# EAGLE design rev_a (EAGLE 7.6.0)
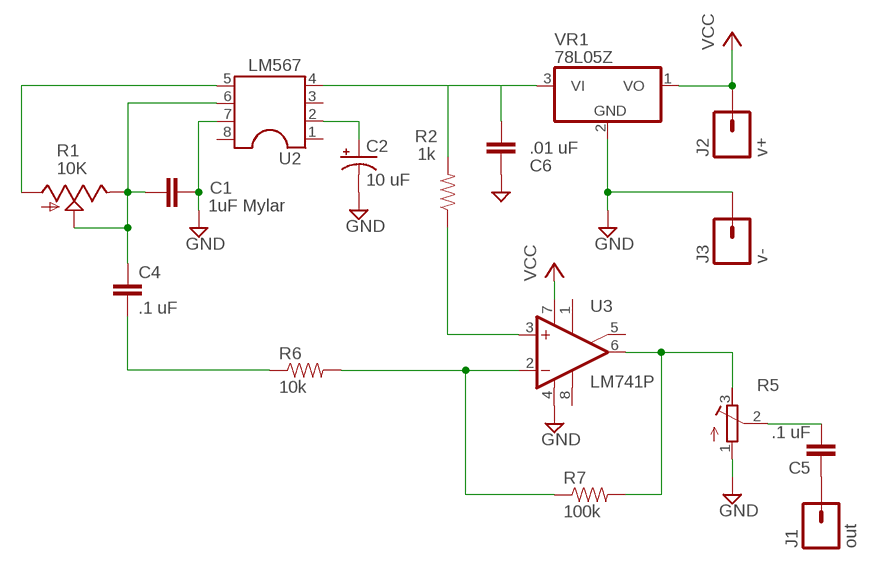
[diagram p0: schematic, sheet 1]

## Parts
C1  1uF Mylar  C5/2.5  [C5B2.5]
C2  10 uF  CAP_POLPTH2  [CPOL-RADIAL-10UF-25V]
C4  .1 uF  C2.5/2  [C2.5-2]
C5  .1 uF  CAPPTH2  [CAP-PTH-SMALL2]
C6  .01 uF  C2.5/2  [C2.5-2]
J1  out  M01OFFSET  [1X01_OFFSET]
J2  v+  M01OFFSET  [1X01_OFFSET]
J3  v-  M01OFFSET  [1X01_OFFSET]
R1  10K  TRIM_US-S64W  [S64W]
R2  1k  1KOHM-1/4W-5%(PTH)VERT  [AXIAL-0.1]
R5  RTRIM-3362P  [RTRIM3362P]
R6  10k  1KOHM-1/4W-5%(PTH)VERT  [AXIAL-0.1]
R7  100k  1KOHM-1/4W-5%(PTH)VERT  [AXIAL-0.1]
U2  LM567  DIL8  [DIL08]
U3  LM741P  [DIL08]
VR1  78L05Z  [TO92]

## Nets
GND: C2.2(-) C6.2 J3.1 R5.1 U3.4(V-) VR1.2(GND)
N$1: C6.1 U2.4 VR1.3(VI)
N$2: R2.P$1 U3.3(+IN)
N$3: R6.P$2 R7.P$1 U3.2(-IN)
N$4: R5.3 R7.P$2 U3.6(OUT)
N$5: C5.2 R5.2
N$6: C4.2 R6.P$1
N$7: C2.1(+) U2.2
N$8: C1.1 C4.1 R1.E R1.S U2.6
N$9: C1.2 U2.7 ; supply symbol labelled GND
N$10: R1.A U2.5
N$11: C5.1 J1.1
N$12: R2.P$2
VCC: J2.1 U3.7(V+) VR1.1(VO)
Unconnected: U2.1 U2.3 U2.8 U3.1(ON1) U3.5(ON2) U3.8(OPT)

## Library data of the parts
C1 C4 C6 = capacitor-wima:C: CAPACITOR naming: grid - package width
C2 = SparkFun-Capacitors:CAP_POL: Capacitor Polarized These are standard SMD and PTH capacitors. Normally 10uF, 47uF, and 100uF in electrolytic and tantalum varieties. Always verify the external diameter of the through hole cap, it varies with capacity, voltage, and manufacturer. The EIA devices should be standard.
C5 = SparkFun-Capacitors:CAP: Capacitor Standard 0603 ceramic capacitor, and 0.1" leaded capacitor.
J1-J3 = SparkFun-Connectors:M01: Header 1 Standard 1-pin 0.1" header. Use with straight break away headers (SKU : PRT-00116), right angle break away headers (PRT-00553), swiss pins (PRT-00743), machine pins (PRT-00117), and female headers (PRT-00115). SMTSO-256-ET is a "flush mount" nut for a 4-40 screw. The older package used to be too tight, and did not allow it to sit properly thru the drill hit. The latest (0.165DIA) fits nice and snug.
R1 = pot:TRIM_US-: POTENTIOMETER
R2 = SparkFun-Resistors:1KOHM-1/4W-5%(PTH): RES-08380; PROD_ID: RES-08380
R5 = GeekAmmo:RTRIM: BOURNS 3362 - 1/4" Square Trimpot® Trimming Potentiometer
R6 R7 = SparkFun-Resistors:1KOHM-1/4W-5%(PTH): RES-08380; PROD_ID: RES-08380; VALUE: 1k
U2 = ic-package:DIL8: Dual In Line / Socket
U3 = linear:*741: OP AMP
VR1 = linear:78*: Positive VOLTAGE REGULATOR Source: http://cache.national.com/ds/LM/LM78L05.pdf http://www.fairchildsemi.com/ds/LM/LM7805.pdf

## Board
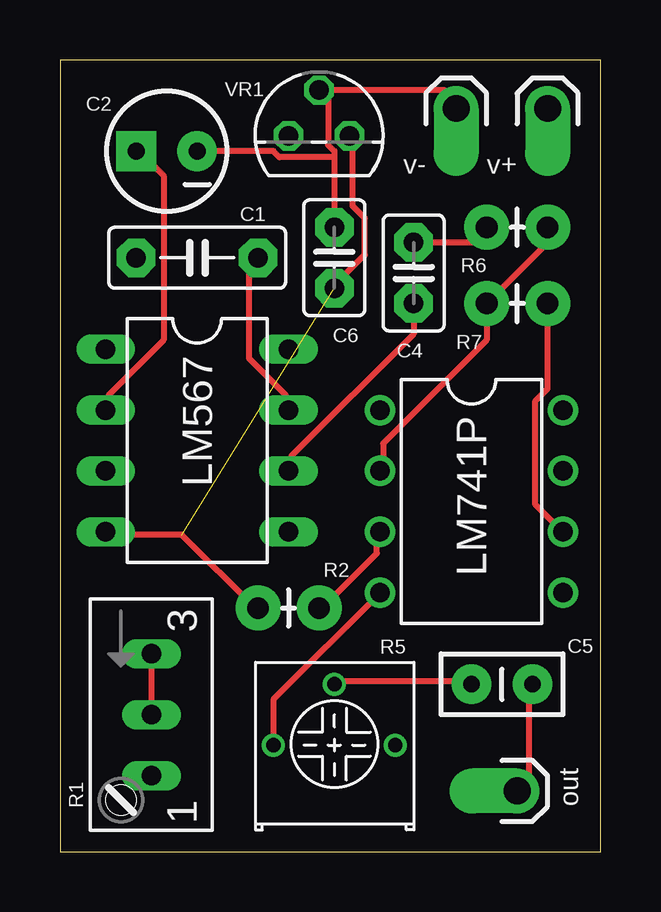
[diagram p1: board, top side]
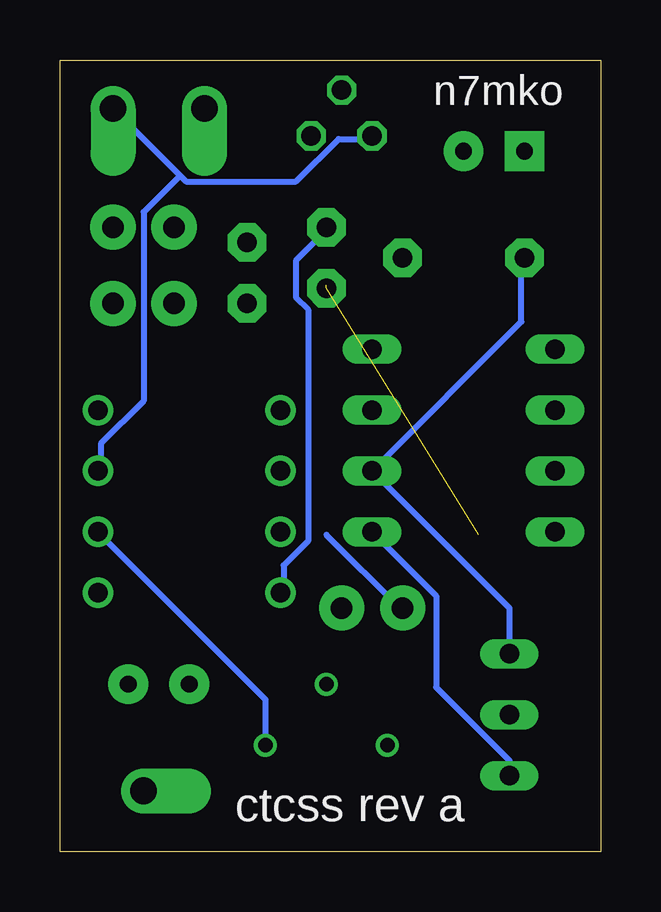
[diagram p2: board, bottom side, seen from below]

Size 22.53 x 33.01 mm. Coordinates in mm from the lower left corner, seen from the top.
Outline: 0,0 22.53,0 22.53,33.01 0,33.01 0,0
Copper layers (1*16): Top 0.0356mm / dielectric 1.5011mm / Bottom 0.0356mm
Design rules "LaenPCBOrder *": minimum track width 10mil, minimum drill 13mil, track to track 10mil, track to pad 6mil, pad to pad 6mil, via to via 6mil, smd to smd 6mil, copper to edge 15mil, drill to drill 6mil, minimum pad ring 7mil, minimum via ring 7mil, stop-mask expansion 3mil, vias tented up to drill 0mil, thermal gap 10mil

### Footprints (pad centres in the part's own frame; a part is rotated, then mirrored left to right if it is on the bottom)
C5B2.5 = drill 0.813 pad 1.6 octagon: 1 -2.54,0; 2 2.54,0
CPOL-RADIAL-10UF-25V = drill 0.7 pad 1.651 square: 1 1.27,0 | drill 0.7 pad 1.651: 2 -1.27,0
C2.5-2 = drill 0.813 pad 1.6 octagon: 1 -1.27,0; 2 1.27,0
CAP-PTH-SMALL2 = drill 0.7 pad 1.651: 1 0,0; 2 2.54,0
1X01_OFFSET = drill 1.118 pad 1.88 offset: 1 0,0
S64W = drill 0.813 long: A 2.54,1.27; E -2.54,1.27; S 0,1.27
AXIAL-0.1 = drill 0.9 pad 1.88: P$1 0,0; P$2 2.54,0
RTRIM3362P = drill 0.6: 1 -2.54,-2.54; 2 0,0; 3 2.54,-2.54
DIL08 = drill 0.813 long: 1 -3.81,-3.81; 2 -1.27,-3.81; 3 1.27,-3.81; 4 3.81,-3.81; 5 3.81,3.81; 6 1.27,3.81; 7 -1.27,3.81; 8 -3.81,3.81
DIL08' = drill 0.813 pad 1.27: 1 -3.81,-3.81; 2 -1.27,-3.81; 3 1.27,-3.81; 4 3.81,-3.81; 5 3.81,3.81; 6 1.27,3.81; 7 -1.27,3.81; 8 -3.81,3.81
TO92 = drill 0.813 octagon: 1 -1.27,0; 2 0,1.905; 3 1.27,0

### Placement (x,y rotation side)
C1  5.71,24.77 0 top
C2  4.45,29.21 180 top
C4  14.73,24.13 90 top
C5  19.68,6.99 180 top
C6  11.43,24.77 90 top
J1  19.05,2.54 90 top
J2  20.32,30.99 180 top
J3  16.51,30.99 180 top
R1  2.54,5.71 270 top
R2  10.79,10.16 180 top
R5  11.43,6.99 0 top
R6  17.78,26.04 0 top
R7  17.78,22.86 0 top
U2  5.71,17.14 270 top
U3  LM741P  [DIL08']  17.14,14.61 270 top
VR1  10.79,29.84 0 top

### Tracks (layer width: path | path; a pad name or v marks a point on that pad's centre or on a via)
GND
  Top 0.254: R5.1 8.89,6.35 U3.4 | 11.18,31.75 16,31.75 16.51,31.24 J3.1 | 11.18,31.75 VR1.2 10.92,31.75 | 11.43,28.96 11.43,29.21 11.18,29.46 11.18,31.75 | 11.43,28.96 C6.2 | C2.2 8.89,29.21 9.14,28.96 11.43,28.96
  Bottom 0.254: U3.4 13.21,10.92 13.21,11.94 12.19,12.95 12.19,22.61 12.7,23.11 12.7,24.64 11.43,25.91 C6.2
N$1  (2 unrouted)
  Top 0.254: 11.43,23.62 12.7,24.89 12.7,26.42 12.19,26.92 12.19,29.72 VR1.3 | 8.13,10.16 5.08,13.21 2.03,13.21 U2.4
N$2
  Top 0.254: U3.3 13.21,13.21 13.21,12.45 10.92,10.16 R2.P$1
N$3
  Top 0.254: U3.2 13.46,16 13.46,17.02 17.78,21.34 R7.P$1 20.32,25.4 R6.P$2
N$4
  Top 0.254: R7.P$2 20.32,19.3 19.81,18.8 19.81,14.48 U3.6
  Bottom 0.254: R5.3 13.97,6.35 U3.6
N$5
  Top 0.254: R5.2 11.43,7.11 17.02,7.11 C5.2
N$6
  Top 0.254: C4.2 17.27,25.4 17.78,25.91 R6.P$1
N$7
  Top 0.254: U2.2 2.03,18.54 2.03,19.05 4.32,21.34 4.32,28.19 3.3,29.21 C2.1
N$8
  Top 0.254: R1.E R1.S | C4.1 14.73,21.59 9.65,16.51 9.65,16 U2.6
  Bottom 0.254: C1.1 3.3,24.64 3.3,22.1 U2.6 3.81,10.16 R1.E
N$9
  Top 0.254: C1.2 7.87,24.38 7.87,20.57 9.4,19.05 9.4,18.54 U2.7
N$10
  Bottom 0.254: R1.A 3.81,3.81 6.86,6.86 6.86,10.67 U2.5
N$11
  Top 0.254: J1.1 19.56,3.05 19.56,6.86 C5.1
N$12
  Bottom 0.254: 11.43,13.21 8.38,10.16 R2.P$2
VCC
  Bottom 0.254: J2.1 17.53,28.19 | 17.53,28.19 17.27,27.94 12.7,27.94 10.92,29.72 9.65,29.72 VR1.1 | 17.53,28.19 19.05,26.67 19.05,18.8 20.83,17.02 20.83,16 U3.7

### Text on the board
bPlace: n7mko | ctcss rev a